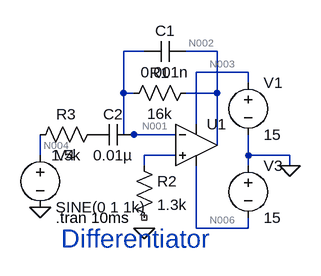
[diagram p0: schematic Draft5.asc]
Draft5.asc, the LTspice schematic file:
Version 4
SHEET 1 880 680
WIRE 272 48 240 48
WIRE 384 48 336 48
WIRE 432 80 352 80
WIRE 432 96 432 80
WIRE 240 112 240 48
WIRE 256 112 240 112
WIRE 384 112 384 48
WIRE 384 112 336 112
WIRE 352 160 352 80
WIRE 240 176 240 112
WIRE 256 176 240 176
WIRE 320 176 256 176
WIRE 384 192 384 112
WIRE 112 208 112 176
WIRE 320 208 272 208
WIRE 432 208 432 176
WIRE 496 208 432 208
WIRE 272 224 272 208
WIRE 432 224 432 208
WIRE 496 224 496 208
WIRE 352 320 352 224
WIRE 432 320 432 304
WIRE 432 320 352 320
FLAG 112 288 0
FLAG 272 320 0
FLAG 496 224 0
SYMBOL OpAmps\\UniversalOpAmp 352 192 R0
SYMATTR InstName U1
SYMBOL voltage 432 80 R0
SYMATTR InstName V1
SYMATTR Value 15
SYMBOL voltage 432 208 R0
SYMATTR InstName V3
SYMATTR Value 15
SYMBOL cap 336 32 R90
WINDOW 0 0 32 VBottom 2
WINDOW 3 32 32 VTop 2
SYMATTR InstName C1
SYMATTR Value 0.001n
SYMBOL res 352 96 R90
WINDOW 0 0 56 VBottom 2
WINDOW 3 32 56 VTop 2
SYMATTR InstName R1
SYMATTR Value 16k
SYMBOL res 256 208 R0
SYMATTR InstName R2
SYMATTR Value 1.3k
SYMBOL res 208 160 R90
WINDOW 0 0 56 VBottom 2
WINDOW 3 32 56 VTop 2
SYMATTR InstName R3
SYMATTR Value 1.5k
SYMBOL voltage 112 192 R0
WINDOW 123 0 0 Left 0
WINDOW 39 0 0 Left 0
SYMATTR InstName V4
SYMATTR Value SINE(0 1 1k)
SYMBOL cap 256 160 R90
WINDOW 0 0 32 VBottom 2
WINDOW 3 32 32 VTop 2
SYMATTR InstName C2
SYMATTR Value 0.01µ
TEXT 144 336 Left 4 ;Differentiator
TEXT 136 304 Left 2 !.tran 10ms

The netlist it stands for:
* Draft5.asc
XU1 N005 N001 N003 N006 N002 level1 Avol=1Meg GBW=10Meg Vos=0 En=0 Enk=0 In=0 Ink=0 Rin=500Meg  ; pins In+ In- V+ V- OUT
V1 N003 0 15
V3 0 N006 15
C1 N002 N001 0.001n
R1 N002 N001 16k
R2 N005 NC_01 1.3k
R3 P001 N004 1.5k
V4 N004 0 SINE(0 1 1k)
C2 N001 P001 0.01µ
* Differentiator
.tran 10ms
.lib UniversalOpAmp1.lib
.backanno
.end

* Results of the author's LTspice run, read from the files saved beside the schematic
* Operating Point, zero values left out:
*   V(n003) = 15 V
*   V(n006) = -15 V
*   I(V1) = -30 nA
*   I(V3) = -30 nA
*   Ix(u1:3) = 30 nA
*   Ix(u1:4) = -30 nA
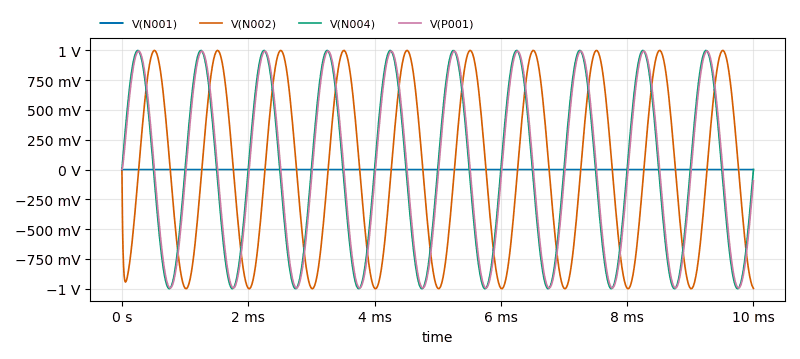
[diagram p1: Transient Analysis of Draft5.asc, plotted from the saved traces]
* Transient Analysis, 1 run:
*   V(N001): min -100.1 µV, max 1.012 mV, average 1.648 µV, rms 76.77 µV, last 9.955 µV
*   V(N002): min -1 V, max 1 V, average 1.549 mV, rms 705.7 mV, last -996.8 mV
*   V(N004): min -999.9 mV, max 999.9 mV, average 1.171 µV, rms 707.1 mV, last 0 V
*   V(P001): min -994.6 mV, max 994.6 mV, average 146.2 µV, rms 703.3 mV, last -93.45 mV